# Altium schematic sheet STM32_microcontroller_IOs.SchDoc: STM32 microcontroller I/Os
size A4; Date: Not used; ApprovedBy: Not used; CheckedBy: Not used; Author: Not used; CompanyName: STMicroelectronics; DrawnBy: Not used; Engineer: Not used; Organization: Not used; Address1: Not used; Address2: Not used; Address3: Not used; Address4: Not used; DocumentNumber: 3; Revision: Not used; SheetNumber: 3; SheetTotal: 8; CurrentTime: Not used; CurrentDate: Not used; Time: Not used; DocumentFullPathAndName: Not used; DocumentName: Not used; ModifiedDate: Not used; ImagePath: Not used; ProjectName: Not used; Application_BuildNumber: Not used
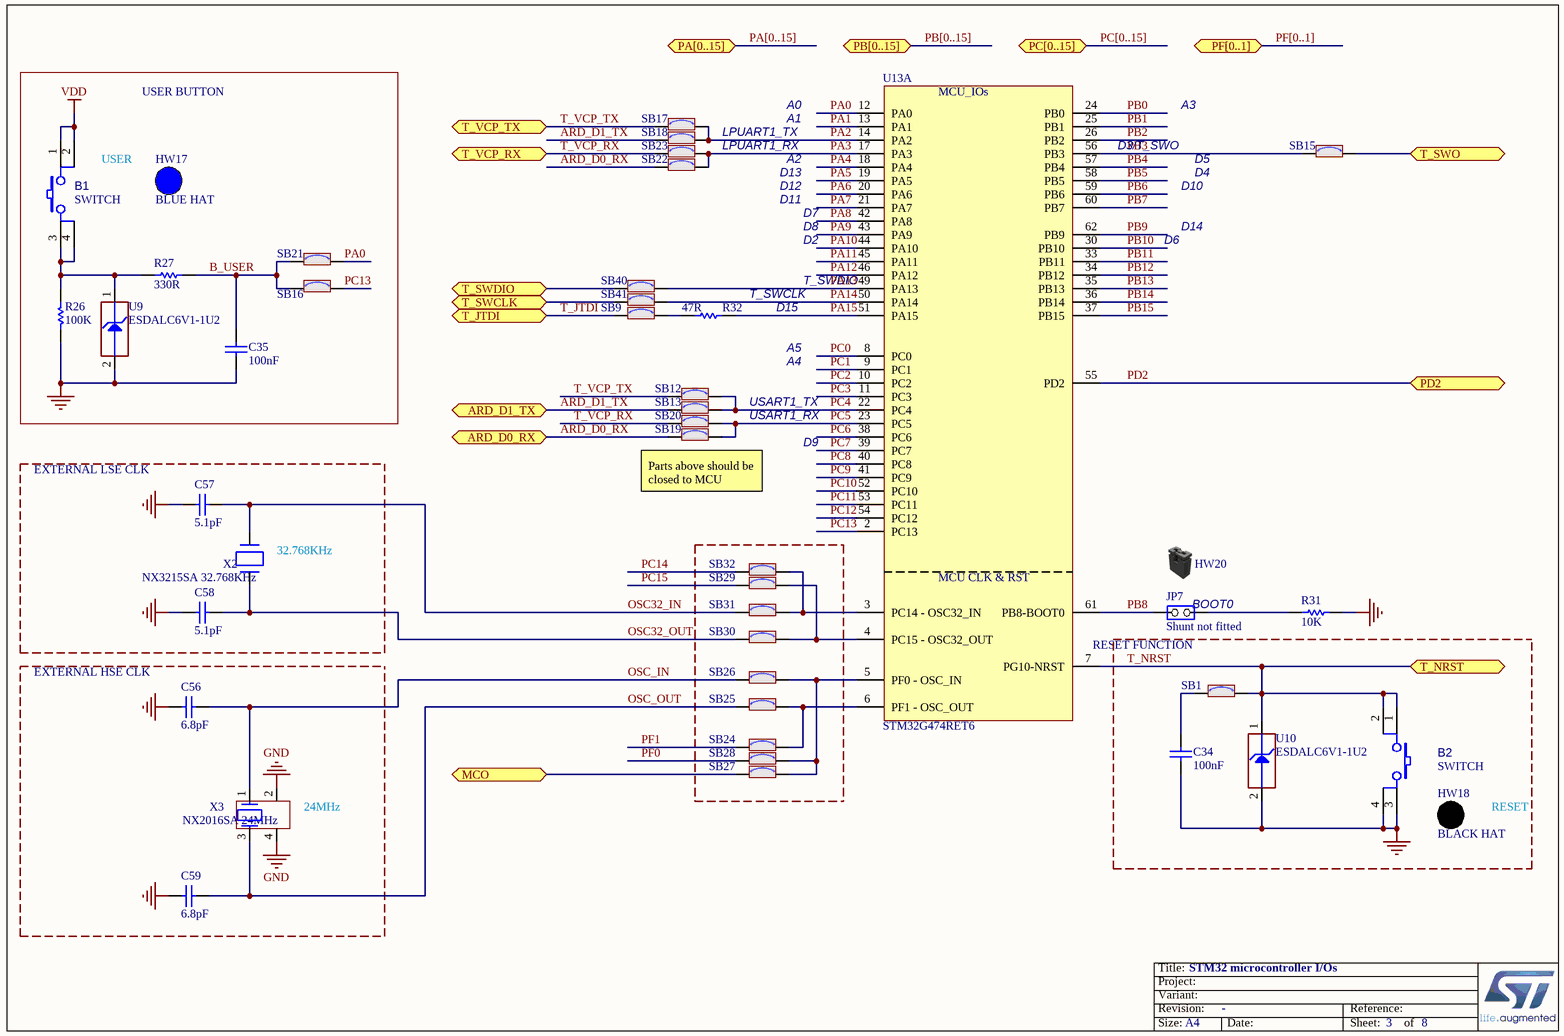
[diagram p0: STM32_microcontroller_IOs.SchDoc]

## Parts
B1  value SWITCH  [SWI_WEALTHMETAL_TD-0341_4P_BLUE]
B2  value SWITCH  [SWI_WEALTHMETAL_TD-0341_4P_BLACK]
C34  value 100nF  [C0402]
C35  value 100nF  [C0402]
C56  value 6.8pF  [C0402]
C57  value 5.1pF  [C0402]
C58  value 5.1pF  [C0402]
C59  value 6.8pF  [C0402]
HW17  value BLUE HAT  (mechanical)
HW18  value BLACK HAT  (mechanical)
HW20  (no value)  (mechanical)
JP7  value Shunt not fitted  [CON_SAMTEC_TSW-102-07-G-S]
R26  value 100K  [R0603]
R27  value 330R  [R0603]
R31  value 10K  [R0603]
R32  value 47R  [R0402]
SB1  (no value)  [SOLDER-BRIDGE_R0603-0R]
SB9  (no value)  [SOLDER-BRIDGE_R0603-0R]
SB12  (no value)  [SOLDER-BRIDGE_R0603-0R]
SB13  (no value)  [SOLDER-BRIDGE_R0603-0R]
SB15  (no value)  [SOLDER-BRIDGE_R0603-0R]
SB16  (no value)  [SOLDER-BRIDGE_R0603-0R]
SB17  (no value)  [SOLDER-BRIDGE_R0603-0R]
SB18  (no value)  [SOLDER-BRIDGE_R0603-0R]
SB19  (no value)  [SOLDER-BRIDGE_R0603-0R]
SB20  (no value)  [SOLDER-BRIDGE_R0603-0R]
SB21  (no value)  [SOLDER-BRIDGE_R0603-0R]
SB22  (no value)  [SOLDER-BRIDGE_R0603-0R]
SB23  (no value)  [SOLDER-BRIDGE_R0603-0R]
SB24  (no value)  [SOLDER-BRIDGE_R0603-0R]
SB25  (no value)  [SOLDER-BRIDGE_R0603-0R]
SB26  (no value)  [SOLDER-BRIDGE_R0603-0R]
SB27  (no value)  [SOLDER-BRIDGE_R0603-0R]
SB28  (no value)  [SOLDER-BRIDGE_R0603-0R]
SB29  (no value)  [SOLDER-BRIDGE_R0603-0R]
SB30  (no value)  [SOLDER-BRIDGE_R0603-0R]
SB31  (no value)  [SOLDER-BRIDGE_R0603-0R]
SB32  (no value)  [SOLDER-BRIDGE_R0603-0R]
SB40  (no value)  [SOLDER-BRIDGE_R0603-0R]
SB41  (no value)  [SOLDER-BRIDGE_R0603-0R]
U9  value ESDALC6V1-1U2  [ESD_ST0201]
U10  value ESDALC6V1-1U2  [ESD_ST0201]
U13  value STM32G474RET6  [ICC_LQFP64_10X10_P050_SOCKET_YAMAICHI_IC149-064-069-B5_NM]  (part A of 2)
X2  value NX3215SA 32.768KHz  [CRY_NX3215SA_2P]
X3  value NX2016SA 24MHz  [CRY_NX2016SA_4P]

## Ports
ARD_D0_RX, ARD_D1_TX, MCO, PA[0..15] (bidir), PB[0..15] (bidir), PC[0..15] (bidir), PD2, PF[0..1] (bidir), T_JTDI, T_NRST, T_SWCLK, T_SWDIO, T_SWO, T_VCP_RX, T_VCP_TX

## Nets
GND: B2.3 B2.4 C34.1 C35.1 C56.1 C57.2 C58.2 C59.1 R26.1 R31.1 U9.2(GND) U10.2(GND) X3.2 X3.4
VDD: B1.1 B1.2
ARD_D0_RX: SB19.2 SB22.2 ; port ARD_D0_RX
ARD_D1_TX: SB13.2 SB18.2 ; port ARD_D1_TX
B_USER: C35.2 R27.2 SB16.1 SB21.1
MCO: SB27.1 ; port MCO
OSC32_IN: C57.1 SB31.1 X2.2(X2)
OSC32_OUT: C58.1 SB30.1 X2.1(X1)
OSC_IN: C56.2 SB26.1 X3.1
OSC_OUT: C59.2 SB25.1 X3.3
PA0: SB21.2 U13.12(PA0)
PA1: U13.13(PA1)
PA2: SB17.2 SB18.1 U13.14(PA2)
PA3: SB22.1 SB23.2 U13.17(PA3)
PA4: U13.18(PA4)
PA5: U13.19(PA5)
PA6: U13.20(PA6)
PA7: U13.21(PA7)
PA8: U13.42(PA8)
PA9: U13.43(PA9)
PA10: U13.44(PA10)
PA11: U13.45(PA11)
PA12: U13.46(PA12)
PA13: SB40.2 U13.49(PA13)
PA14: SB41.2 U13.50(PA14)
PA15: R32.2 U13.51(PA15)
PB0: U13.24(PB0)
PB1: U13.25(PB1)
PB2: U13.26(PB2)
PB3: SB15.1 U13.56(PB3)
PB4: U13.57(PB4)
PB5: U13.58(PB5)
PB6: U13.59(PB6)
PB7: U13.60(PB7)
PB8: JP7.1(COMMON) U13.61(PB8-BOOT0)
PB9: U13.62(PB9)
PB10: U13.30(PB10)
PB11: U13.33(PB11)
PB12: U13.34(PB12)
PB13: U13.35(PB13)
PB14: U13.36(PB14)
PB15: U13.37(PB15)
PC0: U13.8(PC0)
PC1: U13.9(PC1)
PC2: U13.10(PC2)
PC3: U13.11(PC3)
PC4: SB12.2 SB13.1 U13.22(PC4)
PC5: SB19.1 SB20.2 U13.23(PC5)
PC6: U13.38(PC6)
PC7: U13.39(PC7)
PC8: U13.40(PC8)
PC9: U13.41(PC9)
PC10: U13.52(PC10)
PC11: U13.53(PC11)
PC12: U13.54(PC12)
PC13: SB16.2 U13.2(PC13)
PC14: SB32.1
PC15: SB29.1
PD2: U13.55(PD2) ; port PD2
PF0: SB28.1
PF1: SB24.1
T_JTDI: SB9.1 ; port T_JTDI
T_NRST: B2.1 B2.2 SB1.2 U10.1(IO1) U13.7(PG10-NRST) ; port T_NRST
T_SWCLK: SB41.1 ; port T_SWCLK
T_SWDIO: SB40.1 ; port T_SWDIO
T_SWO: SB15.2 ; port T_SWO
T_VCP_RX: SB20.1 SB23.1 ; port T_VCP_RX
T_VCP_TX: SB12.1 SB17.1 ; port T_VCP_TX
NetB1_3: B1.3 B1.4 R26.2 R27.1 U9.1(IO1)
NetC34_2: C34.2 SB1.1
NetJP7_2: JP7.2(NO) R31.2
NetR32_1: R32.1 SB9.2
NetSB24_2: SB24.2 SB25.2 U13.6(PF1_-_OSC_OUT)
NetSB26_2: SB26.2 SB27.2 SB28.2 U13.5(PF0_-_OSC_IN)
NetSB29_2: SB29.2 SB30.2 U13.4(PC15_-_OSC32_OUT)
NetSB31_2: SB31.2 SB32.2 U13.3(PC14_-_OSC32_IN)

## Buses and harness runs
bus PA[0..15] = port PA[0..15]
bus PB[0..15] = port PB[0..15]
bus PC[0..15] = port PC[0..15]
bus PF[0..1] = port PF[0..1]

## Notes on the sheet
- USER BUTTON
- A0
- A3
- USER
- LPUART1_TX
- LPUART1_RX
- A1
- A2
- D13
- D3/T_SWO
- D4
- D5
- D12
- D11
- D2
- D7
- D8
- D14
- D10
- D6
- (near R32) T_SWCLK
- D15
- (near R32) T_SWDIO
- A4
- A5
- USART1_RX
- USART1_TX
- D9
- EXTERNAL LSE CLK
- (near SB19) Parts above should be closed to MCU
- (near X2) 32.768KHz
- RESET FUNCTION
- BOOT0
- EXTERNAL HSE CLK
- (near X3) 24MHz
- RESET
- Title:
- Project:
- Size:
- Revision:
- Variant:
- -
- Date:
- Reference:
- Sheet:
- of
- (in symbol MCD-01243, part A) MCU_IOs; MCU CLK & RST

## Library data of the parts
B1 = MCD-00002: Non-Open Push-Button 0.1A 24V; Manufacturer_Part_Number: TD-0341; Manufacturer: WEALTHMETAL; Part_Type: Misc; Provided_By: SUBCO; Internal_Part_Number: MCD-00002; ECCN_US: n/a; ECCN_EU: n/a; ComponentLink1Description: Datasheet; Status: Released; ComponentLink1URL: http://tunmcdsvn.tun.st.com/Component_Datasheet_Library/Trunk/Misc/Wealthmetal_Tact-Switch_TD0341
B2 = MCD-00001: Non-Open Push-Button 0.1A 24V BLACK; Manufacturer_Part_Number: TD-0341; Manufacturer: WEALTHMETAL; Part_Type: Misc; Provided_By: SUBCO; Internal_Part_Number: MCD-00001; ECCN_US: n/a; ECCN_EU: n/a; ComponentLink1Description: Datasheet; Status: Released; ComponentLink1URL: http://tunmcdsvn.tun.st.com/Component_Datasheet_Library/Trunk/Misc/Wealthmetal_Tact-Switch_TD0341
C34 C35 = MCD-00102: Capacitor, MLCC, 100nF, 16V, X7R, 10%, 0402, T=0,5mm; Manufacturer_Part_Number: CC0402KRX7R7BB104; Manufacturer: YAGEO; Provided_By: Subcon; Initial_Board_Reference: MB1262; Internal_Part_Number: MCD-00102; Status: Released; Package: C0402; ComponentLink1Description: Yageo_Capacitor_X7R-series.pdf; ECCN_US: n/a; ECCN_EU: n/a; Part_Type: Capacitor; ComponentLink1URL: http://tunmcdsvn.tun.st.com/Component_Datasheet_Library/Trunk/Capacitors/Yageo_Multilayer_Capacitor_X7R_series_100pF_to_22uF
C56 C59 = MCD-00674: Capacitor, MLCC, 6.8pF, 50V, NPO, +-0.25pF, 0402, T=0.5mm; Manufacturer_Part_Number: CC0402CRNPO9BN6R8; Manufacturer: YAGEO; Provided_By: SUBCO; Internal_Part_Number: MCD-00674; Status: Released; Part_Type: Capacitor; Package: C0402; ComponentLink1Description: Datasheet; ComponentLink1URL: http://tunmcdsvn.tun.st.com/Component_Datasheet_Library/Trunk/Capacitors/Yageo_Capacitor_NP0_16V-to-50V; ECCN_US: N/A; ECCN_EU: N/A
C57 C58 = MCD-00003: Capacitor, MLCC, 5.1pF, 50V, NPO, +-0.25pF, 0402, T=0.5mm; Manufacturer_Part_Number: CC0402CRNPO9BN5R1; Manufacturer: YAGEO; ECCN_US: EAR99; ECCN_EU: NEC; Provided_By: SUBCO; Internal_Part_Number: MCD-00003; ComponentLink1Description: Datasheet; Status: Released; Part_Type: Capacitor; Package: C0402; ComponentLink1URL: http://tunmcdsvn.tun.st.com/Component_Datasheet_Library/Trunk/Capacitors/Yageo_Capacitor_NP0_16V-to-50V
HW17 = MCD-00634: Blue Hat for switch TD0341X-G01-BLU; Part_Type: Mechanical; Manufacturer_Part_Number: 988.16.09.3.00002_SH-517; Manufacturer: JIUBABA; Provided_By: SUBCO; Internal_Part_Number: MCD-00634; Status: Released; ECCN_US: n/a; ECCN_EU: n/a; ComponentLink1Description: Datasheet; ComponentLink1URL: http://tunmcdsvn.tun.st.com/Component_Datasheet_Library/Trunk/Mechanical/Jiubaba_HAT_SH-517
HW18 = MCD-00635: Black Hat for switch TD0341X-G01-BLA; Part_Type: Mechanical; Manufacturer_Part_Number: 988.16.09.3.00003_SH-517; Manufacturer: JIUBABA; Provided_By: SUBCO; Internal_Part_Number: MCD-00635; Status: Released; ECCN_US: n/a; ECCN_EU: n/a; ComponentLink1Description: Datasheet; ComponentLink1URL: http://tunmcdsvn.tun.st.com/Component_Datasheet_Library/Trunk/Mechanical/Jiubaba_HAT_SH-517
HW20 = MCD-00043: SHUNT 2.54mm BLACK; Manufacturer_Part_Number: SNT-100-BK-G; Manufacturer: SAMTEC; Part_Type: Mechanical; Provided_By: Subcon; Initial_Board_Reference: MB1274; Internal_Part_Number: MCD-00043; ECCN_US: n/a; ECCN_EU: n/a; ComponentLink1Description: Samtec_Shunt_Jumper_SNT100.pdf; Status: Released; ComponentLink1URL: http://tunmcdsvn.tun.st.com/Component_Datasheet_Library/Trunk/Connectors/Samtec_Shunt_Jumper_SNT100
JP7 = MCD-00045: Header, 2x1, 2,54mm, VR, TH, Height 5.84mm/2.54mm; Part_Type: Connector; Manufacturer_Part_Number: TSW-102-07-x-S; Manufacturer: SAMTEC; Provided_By: Subcon; Initial_Board_Reference: MB1274; Internal_Part_Number: MCD-00045; Status: Released; ComponentLink1Description: Samtec_connector_TSW-HTSW-series.pdf; ComponentLink1URL: http://tunmcdsvn.tun.st.com/Component_Datasheet_Library/Trunk/Connectors/Samtec_TSW-HTSW-series; ECCN_US: n/a; ECCN_EU: n/a
R26 = MCD-00223: Resistor,100K,0603,1%,1/10W; Manufacturer_Part_Number: RC0603FR-07100KL; Manufacturer: YAGEO; Provided_By: Subcon; Initial_Board_Reference: MB1319; Internal_Part_Number: MCD-00223; ECCN_US: n/a; ECCN_EU: n/a; ComponentLink1Description: Yageo_Resistor_RC0603-series.pdf; Status: Released; Part_Type: Resistor; Package: R0603; ComponentLink1URL: http://tunmcdsvn.tun.st.com/Component_Datasheet_Library/Trunk/Resistors/Yageo_Resistor_RC0603-series
R27 = MCD-00197: Resistor,330R,0603,1%,1/10W; Manufacturer_Part_Number: RC0603FR-07330RL; Manufacturer: YAGEO; Provided_By: Subcon; Internal_Part_Number: MCD-00197; Status: Released; ComponentLink1Description: Yageo_Resistor_RC0603-series.pdf; ECCN_US: n/a; ECCN_EU: n/a; Part_Type: Resistor; Package: R0603; ComponentLink1URL: http://tunmcdsvn.tun.st.com/Component_Datasheet_Library/Trunk/Resistors/Yageo_Resistor_RC0603-series
R31 = MCD-00220: Resistor,10K,0603,1%,1/10W; Manufacturer_Part_Number: RC0603FR-0710KL; Manufacturer: YAGEO; Provided_By: Subcon; Initial_Board_Reference: MB1319; Internal_Part_Number: MCD-00220; ECCN_US: n/a; ECCN_EU: n/a; ComponentLink1Description: Yageo_Resistor_RC0603-series.pdf; Status: Released; Part_Type: Resistor; Package: R0603; ComponentLink1URL: http://tunmcdsvn.tun.st.com/Component_Datasheet_Library/Trunk/Resistors/Yageo_Resistor_RC0603-series
R32 = MCD-00481: Resistor,47R,0402,1%,1/16W; Manufacturer_Part_Number: RC0402FR-0747RL; Manufacturer: YAGEO; Provided_By: SUBCO; ECCN_US: EAR99; ECCN_EU: NEC; Internal_Part_Number: MCD-00481; Status: Released; Part_Type: Resistor; Package: R0402; ComponentLink1Description: Datasheet; ComponentLink1URL: http://tunmcdsvn.tun.st.com/Component_Datasheet_Library/Trunk/Resistors/Yageo_Resistor_RC0402-series
SB1 SB9 SB12 SB13 SB15-SB32 SB40 SB41 = MCD-00071: Solder Bridge ON; Part_Type: Mechanical; Manufacturer_Part_Number: RC0603JR-070RL; Manufacturer: YAGEO; Provided_By: SUBCO; Internal_Part_Number: MCD-00071; ECCN_US: n/a; ECCN_EU: n/a; Status: Released; Package: SB0603; ComponentLink1Description: Datasheet; ComponentLink1URL: http://tunmcdsvn.tun.st.com/Component_Datasheet_Library/Trunk/Resistors/Yageo_Resistor_RC0603-series
U9 U10 = MCD-00170: ESD protection 6V1; Part_Type: Diode; Manufacturer: STMICROELECTRONICS; ECCN_US: EAR99; ECCN_EU: NEC; Provided_By: Subcon; Initial_Board_Reference: MB1274; Internal_Part_Number: MCD-00170; Status: Released; Manufacturer_Part_Number: ESDALC6V1-1U2; ComponentLink1Description: STM_ESD_ESDALC6V1-1U2.pdf; ComponentLink1URL: http://tunmcdsvn.tun.st.com/Component_Datasheet_Library/Trunk/Diodes/STM_ESD_ESDALC6V1-1U2
U13 = MCD-01243: STM32G474, LQFP64 package,  3D IC footprint with 2D socket footprint.; Manufacturer: STMICROELECTRONICS; BMS_Part_Number: 9175326; Provided_By: SUBCO with ST control; ECCN_US: 3A991A2; ECCN_EU: NEC; Internal_Part_Number: MCD-01243; Status: Checked; Part_Type: IC; Manufacturer_Part_Number: STM32G474RET6; Package: LQFP64; ComponentLink1Description: Datasheet; ComponentLink1URL: http://tunmcdsvn.tun.st.com/Component_Datasheet_Library/Trunk/IC/STM_MCU_STM32G4xx
X2 = MCD-00091: Crystal 32.768kHz, 6pF, +-20ppm, 50Kohms max, SMD; Manufacturer_Part_Number: NX3215SA 32.768KHz EXS00A-MU00525; Manufacturer: NDK; Part_Type: Crystal_Osc; BMS_Part_Number: 9157034; ECCN_US: EAR99; ECCN_EU: NEC; Provided_By: SUBCO; Internal_Part_Number: MCD-00091; ComponentLink1Description: Datasheet; Status: Released; ComponentLink1URL: http://tunmcdsvn.tun.st.com/Component_Datasheet_Library/Trunk/Crystal_Osc/NDK_Crystal-For-ST_NX3215SA 32.768KHz EXS00A-MU00525 (EXS10B-21238); Order_Code_Digikey: 644-1386
X3 = MCD-01036: Crystal 24MHz, 6pF, +-20ppm, 80ohms max, SMD; Part_Type: Crystal_Osc; Manufacturer_Part_Number: NX2016SA 24MHz EXS00A-CS10820; Manufacturer: NDK; BMS_Part_Number: 9157045; ECCN_US: EAR99; ECCN_EU: NEC; Provided_By: SUBCO; Internal_Part_Number: MCD-01036; Status: Released; Package: (2016) 2.0 x 1.6 x 0.45 mm; ComponentLink1Description: Datasheet; ComponentLink1URL: http://tunmcdsvn.tun.st.com/Component_Datasheet_Library/Trunk/Crystal_Osc/NDK_NX2016SA 24MHz EXS00A-CS10820 (EXS10B-27366B); Order_Code_Digikey: 644-1365